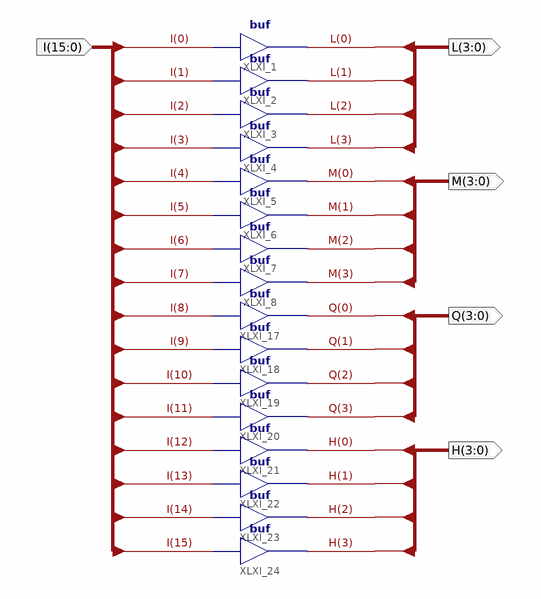
[diagram p0: schematic sheet 1]
// Xilinx ISE schematic split16x4x4x4x4.sch (spartan6) as structural Verilog: 16 symbols, 5 ports
module split16x4x4x4x4 (
  input  [15:0] I,
  output [3:0] M,
  output [3:0] H,
  output [3:0] L,
  output [3:0] Q
);

  buf XLXI_1 (L[0], I[0]);
  buf XLXI_2 (L[1], I[1]);
  buf XLXI_3 (L[2], I[2]);
  buf XLXI_4 (L[3], I[3]);
  buf XLXI_5 (M[0], I[4]);
  buf XLXI_6 (M[1], I[5]);
  buf XLXI_7 (M[2], I[6]);
  buf XLXI_8 (M[3], I[7]);
  buf XLXI_17 (Q[0], I[8]);
  buf XLXI_18 (Q[1], I[9]);
  buf XLXI_19 (Q[2], I[10]);
  buf XLXI_20 (Q[3], I[11]);
  buf XLXI_21 (H[0], I[12]);
  buf XLXI_22 (H[1], I[13]);
  buf XLXI_23 (H[2], I[14]);
  buf XLXI_24 (H[3], I[15]);
endmodule
